# Altium schematic sheet Sheet_1_2024-04-11.schdoc
size 273 x 132 mm
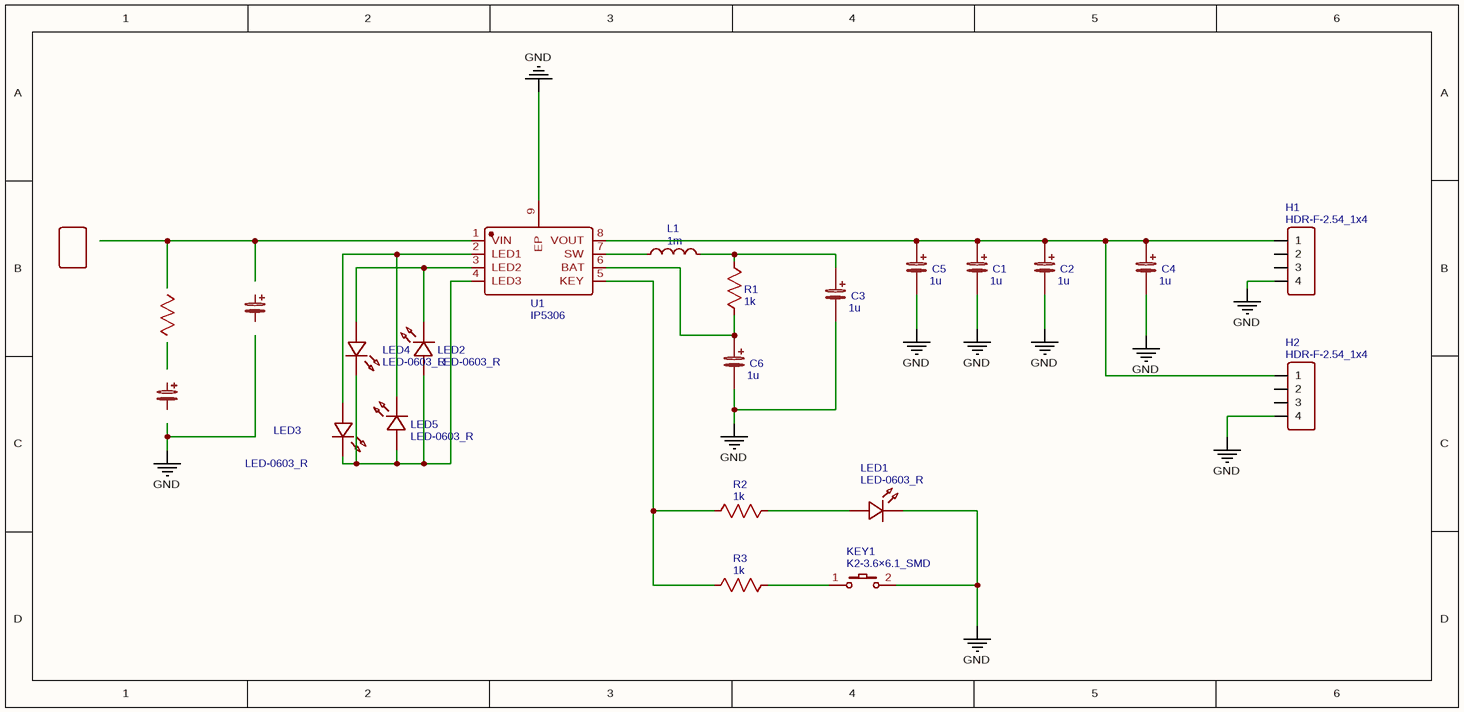
[diagram p0: Sheet_1_2024-04-11.schdoc]

## Parts
C1  1u  [CASE-A_3216]
C2  1u  [CASE-A_3216]
C3  1u  [CASE-A_3216]
C4  1u  [CASE-A_3216]
C5  1u  [CASE-A_3216]
C6  1u  [CASE-A_3216]
H1  HDR-F-2.54_1x4  [HDR-F-2.54_1X4]
H2  HDR-F-2.54_1x4  [HDR-F-2.54_1X4]
KEY1  K2-3.6×6.1_SMD  [KEY-SMD_2P-L6.2-W3.6-LS8.0]
L1  1m  [L0603]
LED1  LED-0603_R  [LED0603_RED]
LED2  LED-0603_R  [LED0603_RED]
LED3  LED-0603_R  [LED0603_RED]
LED4  LED-0603_R  [LED0603_RED]
LED5  LED-0603_R  [LED0603_RED]
R1  1k  [R0603]
R2  1k  [R0603]
R3  1k  [R0603]
U1  IP5306  [ESOP-8_L4.9-W3.9-P1.27-LS6.0-BL-EP]

## Nets
GND: C1.2 C2.2 C3.2 C4.2 C5.2 C6.2 H1.4 H2.4 KEY1.2 LED1.2 U1.9(EP)
NetC1_1: C1.1 C2.1 C4.1 C5.1 H1.1 H2.1 U1.8(VOUT)
NetC3_1: C3.1 L1.2 R1.1
NetC6_1: C6.1 R1.2 U1.6(BAT)
NetKEY1_1: KEY1.1 R3.2
NetL1_1: L1.1 U1.7(SW)
NetLED1_1: LED1.1 R2.2
NetLED2_1: LED2.1 LED3.2 LED4.2 LED5.1 U1.4(LED3)
NetLED2_2: LED2.2 LED4.1 U1.3(LED2)
NetLED3_1: LED3.1 LED5.2 U1.2(LED1)
NetR2_1: R2.1 R3.1 U1.5(KEY)

Not connected (* = marked no-connect by the designer): H1 2 3; H2 2 3; U1 1(VIN)

## Library data of the parts
C1-C6 = 1u: nameAlias: Value(F); Contributor: LCEDA_Lib; spicePre: C; spiceSymbolName: C_Tan_SMD_A_EU
H1 H2 = HDR-F-2.54_1x4: Contributor: LCEDA_Lib; Supplier Part: C225501; Supplier: LCSC; spicePre: H; spiceSymbolName: HDR-F-2.54_1x4
KEY1 = K2-3.6×6.1_SMD: Manufacturer Part: K2-1107ST-A4SW-06; Contributor: LCEDA_Lib; 制造商: 韩国韩荣; Supplier Part: C118141; Supplier: LCSC; spicePre: K; spiceSymbolName: K2-3.6×6.1_SMD
L1 = 1m: nameAlias: Value(H); Contributor: LCEDA_Lib; spicePre: L; spiceSymbolName: L0603_US
LED1-LED5 = LED-0603_R: Manufacturer: EVERLIGHT(台湾亿光); Manufacturer Part: 19-217/R6C-AL1M2VY/3T; Contributor: LCEDA_01; Supplier Part: C72044; Supplier: LCSC; spicePre: L; spiceSymbolName: LED-0603_R
R1-R3 = 1k: nameAlias: Value(Ω); Contributor: LCEDA_Lib; spicePre: R; spiceSymbolName: R_0603_US
U1 = IP5306: Manufacturer: INJOINIC(英集芯); Contributor: LCSC; Supplier: LCSC; Supplier Part: C181692; Manufacturer Part: IP5306; spicePre: U; spiceSymbolName: IP5306